# Altium schematic sheet Duaghter_STM.SchDoc
size A3; SheetNumber: 1; SheetTotal: 3
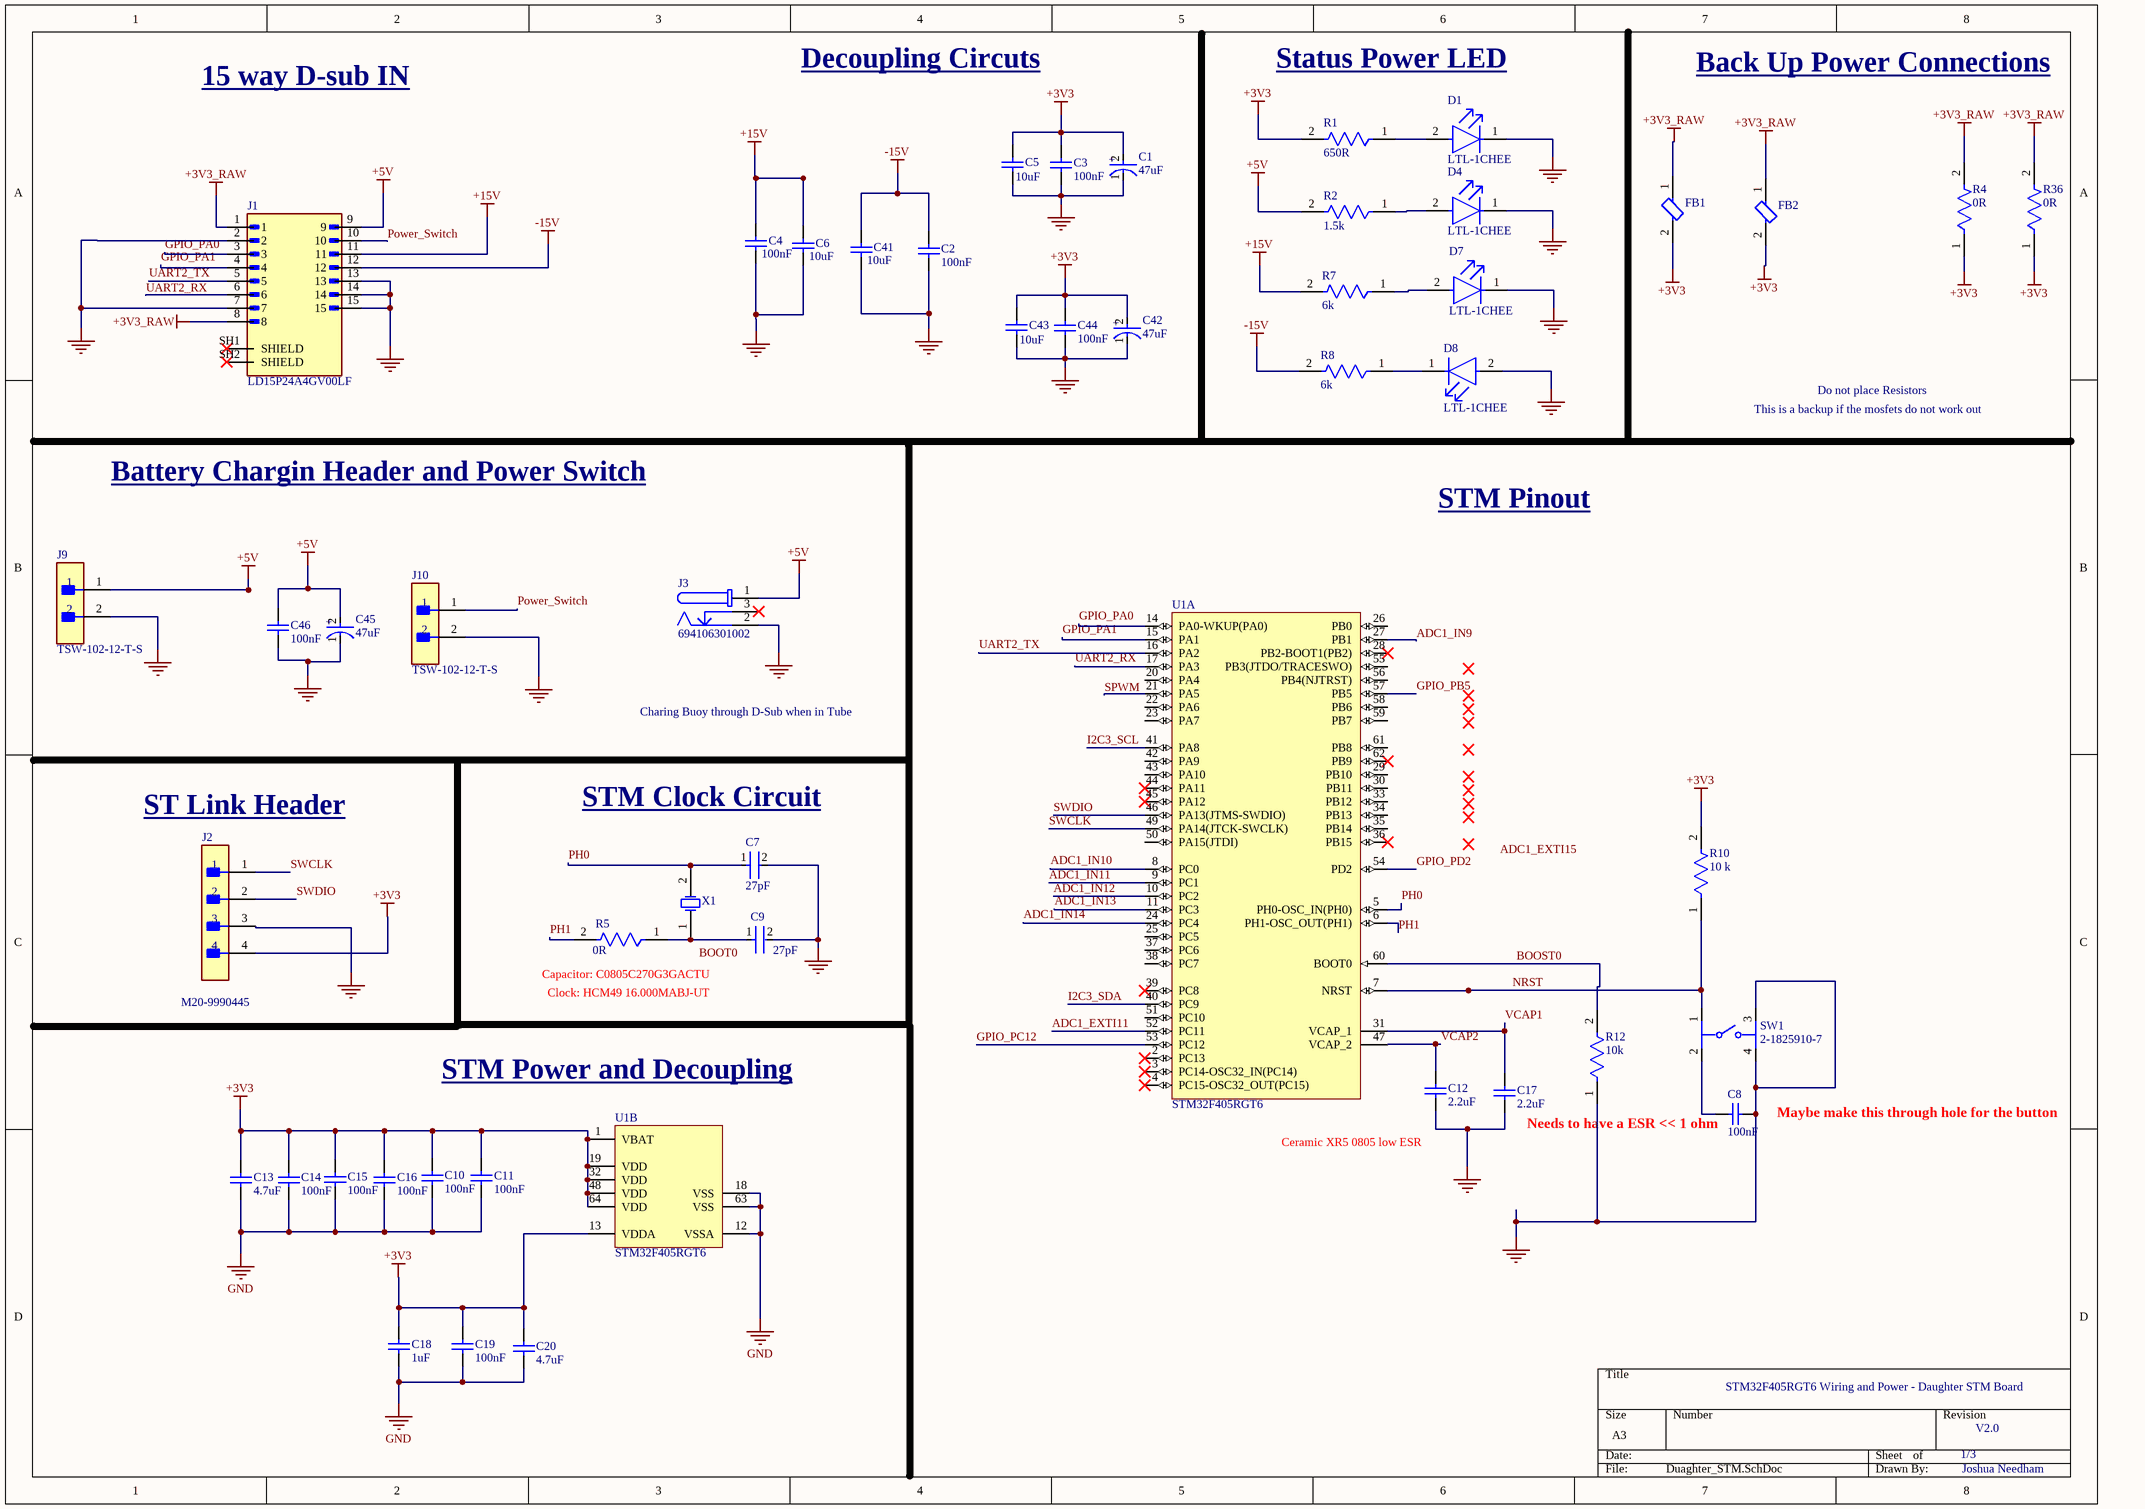
[diagram p0: Duaghter_STM.SchDoc]

## Parts
C1  47uF  [FP-RAD-TH-D_5_0_5-L_11_1-MFG]
C2  100nF  [CAPC0805(2012)100_M]
C3  100nF  [CAPC0805(2012)100_M]
C4  100nF  [CAPC0805(2012)100_M]
C5  10uF  [CAPC0805(2012)100_M]
C6  10uF  [CAPC0805(2012)100_M]
C7  27pF  [FP-GRM21A-0_2-IPC_A]
C8  100nF  [CAPC0805(2012)100_M]
C9  27pF  [FP-GRM21A-0_2-IPC_A]
C10  100nF  [CAPC0805(2012)100_M]
C11  100nF  [CAPC0805(2012)100_M]
C12  2.2uF  [CAPC0805(2012)100_M]
C13  4.7uF  [CAPC2013X140X50NL20T25]
C14  100nF  [CAPC0805(2012)100_M]
C15  100nF  [CAPC0805(2012)100_M]
C16  100nF  [CAPC0805(2012)100_M]
C17  2.2uF  [CAPC0805(2012)100_M]
C18  1uF  [CAPC2013X140X50NL20T25]
C19  100nF  [CAPC0805(2012)100_M]
C20  4.7uF  [CAPC2013X140X50NL20T25]
C41  10uF  [CAPC0805(2012)100_M]
C42  47uF  [FP-RAD-TH-D_5_0_5-L_11_1-MFG]
C43  10uF  [CAPC0805(2012)100_M]
C44  100nF  [CAPC0805(2012)100_M]
C45  47uF  [FP-RAD-TH-D_5_0_5-L_11_1-MFG]
C46  100nF  [CAPC0805(2012)100_M]
D1  LTL-1CHEE  [FP-LTL-1CHEE-MFG]
D4  LTL-1CHEE  [FP-LTL-1CHEE-MFG]
D7  LTL-1CHEE  [FP-LTL-1CHEE-MFG]
D8  LTL-1CHEE  [FP-LTL-1CHEE-MFG]
FB1  BLM21PG601SN1D  [FP-BLM21-0_2-t0_85-e0_5-MFG]  (value not drawn)
FB2  BLM21PG601SN1D  [FP-BLM21-0_2-t0_85-e0_5-MFG]  (value not drawn)
J1  LD15P24A4GV00LF  [AMPHENOL_LD15P24A4GV00LF]
J2  M20-9990445  [FP-M20-9990445-MFG]
J3  694106301002  [694106301002]
J9  TSW-102-12-T-S  [FP-TSW-102-12-T-S-MFG]
J10  TSW-102-12-T-S  [FP-TSW-102-12-T-S-MFG]
R1  650R  [FP-CRCW0805-e3-IPC_A]
R2  1.5k  [FP-CRCW0805-e3-IPC_A]
R4  0R  [FP-CRCW0805-e3-IPC_A]
R5  0R  [FP-CRCW0805-e3-IPC_A]
R7  6k  [FP-CRCW0805-e3-IPC_A]
R8  6k  [FP-CRCW0805-e3-IPC_A]
R10  10 k  [FP-CRCW0805-e3-IPC_A]
R12  10k  [FP-CRCW0805-e3-IPC_A]
R36  0R  [FP-CRCW0805-e3-IPC_A]
SW1  2-1825910-7  [FP-2-1825910-7-MFG]
U1  STM32F405RGT6  [STM-LQFP64_M]  (parts A,B of 2)
X1  HCM49-8.000MABJ-UT  [CFM-HCM49-2_V]  (value not drawn)

## Nets
+3V3: C1.2(A) C3.2 C5.2 C10.2 C11.2 C13.2 C14.2 C15.2 C16.2 C18.2 C19.2 C20.2 C42.2(A) C43.2 C44.2 FB1.2 FB2.2 J2.4 R1.2 R4.1 R10.2 R36.1 U1.1(VBAT) U1.13(VDDA) U1.19(VDD) U1.32(VDD) U1.48(VDD) U1.64(VDD)
+3V3_RAW: FB1.1 FB2.1 J1.1 J1.8 R4.2 R36.2
+5V: C45.2(A) C46.2 J1.9 J3.1 J9.1 R2.2
+15V: C4.2 C6.2 J1.11 R7.2
-15V: C2.2 C41.2 J1.12 R8.2
GND: C1.1(C) C2.1 C3.1 C4.1 C5.1 C6.1 C7.2 C8.1 C9.2 C10.1 C11.1 C12.1 C13.1 C14.1 C15.1 C16.1 C17.1 C18.1 C19.1 C20.1 C41.1 C42.1(C) C43.1 C44.1 C45.1(C) C46.1 D1.1(C) D4.1(C) D7.1(C) D8.2(A) J1.2 J1.7 J1.13 J1.14 J1.15 J2.3 J3.2 J9.2 J10.2 R12.1 SW1.3 SW1.4 U1.12(VSSA) U1.18(VSS) U1.63(VSS)
ADC1_EXTI11: U1.52(PC11)
ADC1_IN9: U1.27(PB1)
ADC1_IN10: U1.8(PC0)
ADC1_IN11: U1.9(PC1)
ADC1_IN12: U1.10(PC2)
ADC1_IN13: U1.11(PC3)
ADC1_IN14: U1.24(PC4)
BOOST0: R12.2 U1.60(BOOT0)
GPIO_PA0: J1.3 U1.14(PA0-WKUP(PA0))
GPIO_PA1: J1.4 U1.15(PA1)
GPIO_PB5: U1.57(PB5)
GPIO_PC12: U1.53(PC12)
GPIO_PD2: U1.54(PD2)
I2C3_SCL: U1.41(PA8)
I2C3_SDA: U1.40(PC9)
NRST: R10.1 SW1.1 U1.7(NRST)
PH0: C7.1 U1.5(PH0-OSC_IN(PH0)) X1.2(X2)
PH1: R5.2 U1.6(PH1-OSC_OUT(PH1))
Power_Switch: J1.10 J10.1
SPWM: U1.21(PA5)
SWCLK: J2.1 U1.49(PA14(JTCK-SWCLK))
SWDIO: J2.2 U1.46(PA13(JTMS-SWDIO))
UART2_RX: J1.6 U1.17(PA3)
UART2_TX: J1.5 U1.16(PA2)
VCAP1: C17.2 U1.31(VCAP_1)
VCAP2: C12.2 U1.47(VCAP_2)
NetC8_2: C8.2 SW1.2
NetC9_1: C9.1 R5.1 X1.1(X1)
NetD1_2: D1.2(A) R1.1
NetD4_2: D4.2(A) R2.1
NetD7_2: D7.2(A) R7.1
NetD8_1: D8.1(C) R8.1

Not connected (* = marked no-connect by the designer): J1 SH1(SHIELD)* SH2(SHIELD)*; J3 3*; U1 2(PC13)* 3(PC14-OSC32_IN(PC14))* 4(PC15-OSC32_OUT(PC15))* 20(PA4) 22(PA6) 23(PA7) 25(PC5) 26(PB0) 28(PB2-BOOT1(PB2))* 29(PB10) 30(PB11) 33(PB12) 34(PB13) 35(PB14) 36(PB15)* 37(PC6) 38(PC7) 39(PC8)* 42(PA9) 43(PA10) 44(PA11)* 45(PA12)* 50(PA15(JTDI)) 51(PC10) 55(PB3(JTDO/TRACESWO)) 56(PB4(NJTRST)) 58(PB6) 59(PB7) 61(PB8) 62(PB9)*

## Notes on the sheet
- 15 way D-sub IN
- Decoupling Circuts
- Status Power LED
- Back Up Power Connections
- This is a backup if the mosfets do not work out
- Do not place Resistors
- Battery Chargin Header and Power Switch
- STM Pinout
- Charing Buoy through D-Sub when in Tube
- (near J2) ST Link Header
- (near C7) STM Clock Circuit
- (near R5) Capacitor: C0805C270G3GACTU
- Clock: HCM49 16.000MABJ-UT
- (near U1) STM Power and Decoupling
- (near C8) Needs to have a ESR << 1 ohm
- (near C8) Maybe make this through hole for the button
- Ceramic XR5 0805 low ESR
- STM32F405RGT6 Wiring and Power - Daughter STM Board
- 1/3
- V2.0
- Joshua Needham
- Labels drawn without touching a wire or pin: ADC1_EXTI15, BOOT0
- (in symbol CMP-05427-000260-1) +

## Library data of the parts
C1 C42 C45 = CMP-05427-000260-1: Aluminum Electrolytic Capacitors (Radial Lead Type) AEC-Q200 Qualified 10uF ±20% 50V; Lead Diameter: 0.5mm; Polarity: Polar; Leakage Current: 3uA; Life (Hours): 1000Hour; Ripple Current: 39mA; Lead/Base Style: Straight; Max Operating Temperature: 105°C; Voltage Rating (DC): 50V; Diameter: 5mm; RoHS Compliant: Yes; Capacitance: 10uF; Packaging: Ammo Pack; Series: NHG; Construction: RADIAL; Length: 11mm; Tolerance: 20%; Height - Seated (Max): 0.472inch; Contact Plating: Tin; Height: 11mm; Min Operating Temperature: -55°C; Radiation Hardening: No; Package Quantity: 2000; Mount: Through Hole; Voltage Rating: 50V; Lead Pitch: 2.5mm; Termination: Radial; Lead Free: Lead Free; Case/Package: Radial
C2-C6 C8 C10-C12 C14-C17 C19 C41 C43 C44 C46 = CMP-1036-04393-1: CAP 100nF 10V ±5% 0805 (2012 Metric) Thickness 1mm SMD; Tolerance: Â±5%; Case-EIA: 0805; Case-Metric: 2012; Rated Voltage: 10 V; Technology: SMT; Value: 100nF; Max Thickness: 1 mm
C7 C9 = CMP-06035-033407-1: Chip Multilayer Ceramic Capacitors for General Purpose, 0805, 22pF, C0G, 30ppm/°C, 1%, 630V GRM21A5C2J220FWA1D
C13 C18 C20 = CMP-2007-04673-1: Manufacturer: AVX Interconnect / Elco; Part Number: 0805ZC105KAT4A
D1 D4 D7 D8 = CMP-22017-000040-1: LED RED CLEAR T/H; Viewing Angle: 45°; Power Dissipation: 100mW; Wavelength: 635nm; Number of LEDs: 1; Test Current: 10mA; Lens Style: Dome; Forward Current: 30mA; Forward Voltage: 2V; Luminous Intensity: 19mcd; Reverse Voltage: 5V; Dominant Wavelength: 625nm; RoHS Compliant: Yes; Mount: Through Hole; Diameter: 3.1mm; Package Quantity: 1000; Lens Transparency: Clear; Illumination Color: Red; Lens Color: Red; Max Operating Temperature: 100°C; Radiation Hardening: No; Case/Package: T; Width: 3.8mm; Length: 3.8mm; Depth: 3.8mm; Series: -; Number of Pins: 2; Number of Elements: 1; Height: 5.2mm; Max Power Dissipation: 100mW; Lead Free: Lead Free; Packaging: Bulk; Color: Red; Min Operating Temperature: -55°C
FB1 FB2 = CMP-0686-00622-4: Chip Ferrite Bead, 0805, 22Ω @ 100MHz, 0.009Ω, 25%, 6A; Manufacturer Series: BLM21P; Resistance: 10mR; DC Resistance-Max: 9mR; Material: Steel; Number of Circuits: 1; Impedance: 22R; Shielding: Unshielded; DC Current: 6A; Termination: SMD/SMT; Max Operating Temperature: 125°C; Case Code (Metric): 2012; Radiation Hardening: No; Length: 2mm; Case Code (Imperial): 0805; RoHS Compliant: Yes; Max Current Rating: 6A; DC Resistance (DCR): 9mR; Case/Package: 0805; Core Material: Ferrite; Width: 1.25mm; Weight: 0.000194oz; Number of Pins: 2; Packaging: Tape and Reel; REACH SVHC: No SVHC; Tolerance: 25%; Height: 0.85mm; Number of Functions: 1; Lead Free: Lead Free; Terminal Finish: Tin; Number of Lines: 1; Package Quantity: 1; Series: BLM21P; Test Frequency: 100MHz; Min Operating Temperature: -55°C; Max DC Current: 6A; Current Rating: 6A; Depth: 1.25mm
J1 = LD15P24A4GV00LF: D-Subminiature Economy Range, Input Output Connectors, Signal 15 way Pin Straight, Solder, 50 cycles, Harpoons + Female Screw UNC 4 - 40 + Elec cont., 1.6 mm PCB thickness; MF: AMPHENOL ICC / FCI; SnapEDA_Link: https://www.snapeda.com/parts/LD15P24A4GV00LF/Amphenol/view-part/?ref=snap; Package: None; Value: *; MP: LD15P24A4GV00LF; Check_prices: https://www.snapeda.com/parts/LD15P24A4GV00LF/Amphenol/view-part/?ref=eda
J2 = CMP-00671-05399696-1: M20-9990445 Conn Unshrouded Header HDR 4 POS 2.54mm Solder ST Thru-Hole Bulk/Loose; Insulation Resistance: 10GΩ; Connector Type: Male Pin; Voltage Rating (DC): 750V; Max Current Rating: 3A; Contact Resistance: 25mΩ; Number of Contacts: 4; Gender: Male; Color: Black; Height: 2.54mm; Contact Material: Brass, Bronze, Gold, Nickel; Orientation: Straight; Width: 12.7mm; Mount: Through Hole; Pitch: 2.54mm; Lead Pitch: 2.54mm; RoHS: Compliant; Max Operating Temperature: 105°C; Case/Package: SIL; NexarPartId: 5399696; Depth: 2.54mm; Length: 10.16mm; Current Rating: 3A; Contact Plating: Gold; Radiation Hardening: No; Contact Mating Length: 6.096mm; Voltage Rating (AC): 750V; Termination: Solder; REACH SVHC: No SVHC; Weight: 45.359237g; Number of Rows: 1; Min Operating Temperature: -40°C; Housing Material: Nylon; Housing Color: Black; Number of Positions: 4; Number of Pins: 4
J3 = CMP-1502-00188-3: DC Power Jack Connector WR-DC, Male, Right Angled, THT, 5 A, 24 V; Operating Supply Voltage: 24V; Shielding: Unshielded; Current Rating: 5A; Number of Contacts: 3; Insulation Resistance: 100MΩ; Termination: Through Hole; RoHS: Compliant; Contact Plating: Tin; Connector Type: Power; Contact Material: Gold, Tin; Packaging: Bulk; Min Operating Temperature: -40°C; REACH SVHC: Unknown; Housing Material: Polyamide; Contact Gender: Female; Height: 11mm; Gender: Male; Color: Black; Voltage Rating: 24V; Flammability Rating: UL94 V-0; Max Operating Temperature: 85°C; Mount: Through Hole
J9 J10 = CMP-02766-001444-1: CONN HEADER VERT 2POS 2.54MM; Gender: Male; Number of Contacts: 2; RoHS Compliant: Yes; Mount: Through Hole; Termination: Solder; Packaging: Bulk; Contact Material: Bronze; Contact Plating: Tin; Number of Rows: 1; REACH SVHC: No SVHC; Pitch: 2.54mm; Radiation Hardening: No
R1 R2 R4 R5 R7 R8 R10 R12 R36 = CMP-2001-04067-2: RES Thick Film, 680Ω, 5%, 0.125W, 200ppm/°C, 0805; Resistance: 680R; Max Power Dissipation: 125mW; Voltage Rating: 150V; Case Code (Imperial): 0805; Packaging: Tape and Reel; Max Operating Temperature: 155°C; Temperature Coefficient: 200ppm/°C; Case/Package: 0805; Features: Automotive AEC-Q200; Width: 1.25mm; Contact Plating: Tin; Weight: 0.000194oz; Radiation Hardening: No; Case Code (Metric): 2012; Military Standard: Not; Lead Free: Lead Free; Length: 2mm; Depth: 1.25mm; Composition: Thick Film; Power Rating: 125mW; Height: 0.45mm; Min Operating Temperature: -55°C; Number of Terminations: 2; Number of Pins: 2; Tolerance: 5%; Package Quantity: 1; Voltage Rating (DC): 150V; Termination: SMD/SMT
SW1 = CMP-03402-000004-1: SWITCH TACTILE SPST-NO 0.05A 24V; Manufacturer: TE Connectivity; Contact Current Rating: 50mA; Operating Force: 160gf; Electromechanical Life: 100000Cycles; Contact Resistance: 100mΩ; ComponentLink2Description: Datasheet; Height: 13.3mm; Digikey Description: SWITCH TACTILE SPST-NO 0.05A 24V; Device Class L2: Switches; Category: Switch; Device Class L3: Pushbutton Switches; Manufacturer Part Number: 2-1825910-7; Device Class L1: Electromechanical; Mount: Through Hole; Temperature Range High: +85°C; ComponentLink2URL: https://www.te.com/commerce/DocumentDelivery/DDEController?Action=showdoc&DocId=Customer+Drawing%7F1825910%7FC10%7Fpdf%7FEnglish%7FENG_CD_1825910_C10.pdf%7F2-1825910-7; RoHS: TRUE; Temperature: -35°C to +85°C; Mouser Description: Switch Tactile OFF (ON) SPST Extended Round Button PC Pins 0.05A 24VDC 100000Cycles 1.57N Thru-Hole Loose; Automotive: No; Voltage Rating Dc: 24V; Package: 2-1825910-7; Lead Free: Yes; Octopart: https://octopart.com/2-1825910-7-te+connectivity-42270510; Temperature Range Low: -35°C; Throw Configuration: SPST-NO
U1 = CMP-0243-00019-3: ARM Cortex-M4 32-bit MCU+FPU, 210 DMIPS, 1024 kB Flash, 192 kB Internal RAM, 51 I/Os, 64-pin LQFP, -40 to 85 degC, Tray; Manufacturer: STMicroelectronics; Supply Voltage(Vcc) min (V): 1.8; Supply Voltage(Vcc) max (V): 3.6; Internal RAM Size (kB): 192; I/Os (High Current): 51; D/A Converter: 2x12-bit; FLASH Size (Prog) (kB): 1024; Operating Frequency(F) (Processor speed) (MHz): 168; ComponentLink2Description: Datasheet; PackageVersion: Rev. 4, 06/2013; DatasheetVersion: Rev. 4; Core: ARM Cortex-M4; ComponentLink2URL: http://www.st.com/st-web-ui/static/active/en/resource/technical/document/datasheet/DM00037051.pdf; PackageReference: LQFP64; Packing: Tray; ComponentLink1Description: Manufacturer URL; ComponentLink3URL: http://www.st.com/st-web-ui/static/active/en/resource/technical/document/datasheet/DM00037051.pdf; ComponentLink3Description: Package Specification; Mounting Technology: Surface Mount; ComponentLink1URL: http://www.st.com/web/en/home.html; PackageDescription: 64-Pin Low Profile Quad Flat Package, 10 x 10 mm Body, 0.5 mm Pitch; PartNumber: STM32F405RGT6
X1 = CMP-1215-00001-1: At-Cut Crystal Unit, 3.5 to 30 MHz, -40 to 85 degC, 2-Pin 11.4Ã—4.7Ã—4.3 mm SMD, RoHS, Reel; Manufacturer: Citizen Finetech Miyota; DL: 100 uW; C0: 7 pF Max.; R1: 50 to 200 Ohm; IR: 500 MOhm Min.; f0: 3.5 to 30 MHz; Mounting Technology: Surface Mount; Packing: Reel; ComponentLink2URL: http://cfm.citizen.co.jp/english/product/pdf/HCM49.pdf; PartNumber: HCM49-8.000MABJ-UT; Operating Temperature: -40 to 85 degC; ComponentLink3URL: http://cfm.citizen.co.jp/english/product/pdf/HCM49.pdf; ComponentLink2Description: Datasheet; ComponentLink3Description: Package Specification; ComponentLink1Description: Manufacturer URL; PackageDescription: 2-Pin Surface Mount, Body 11.4 x 4.7 mm, Pitch 8.5 mm; DatasheetVersion: Jan-12; RoHS: TRUE; ComponentLink1URL: http://cfm.citizen.co.jp/english/index.html